# Altium schematic sheet [17] - PLUGS.SchDoc
size A4; DrawnBy: Philip Rowse
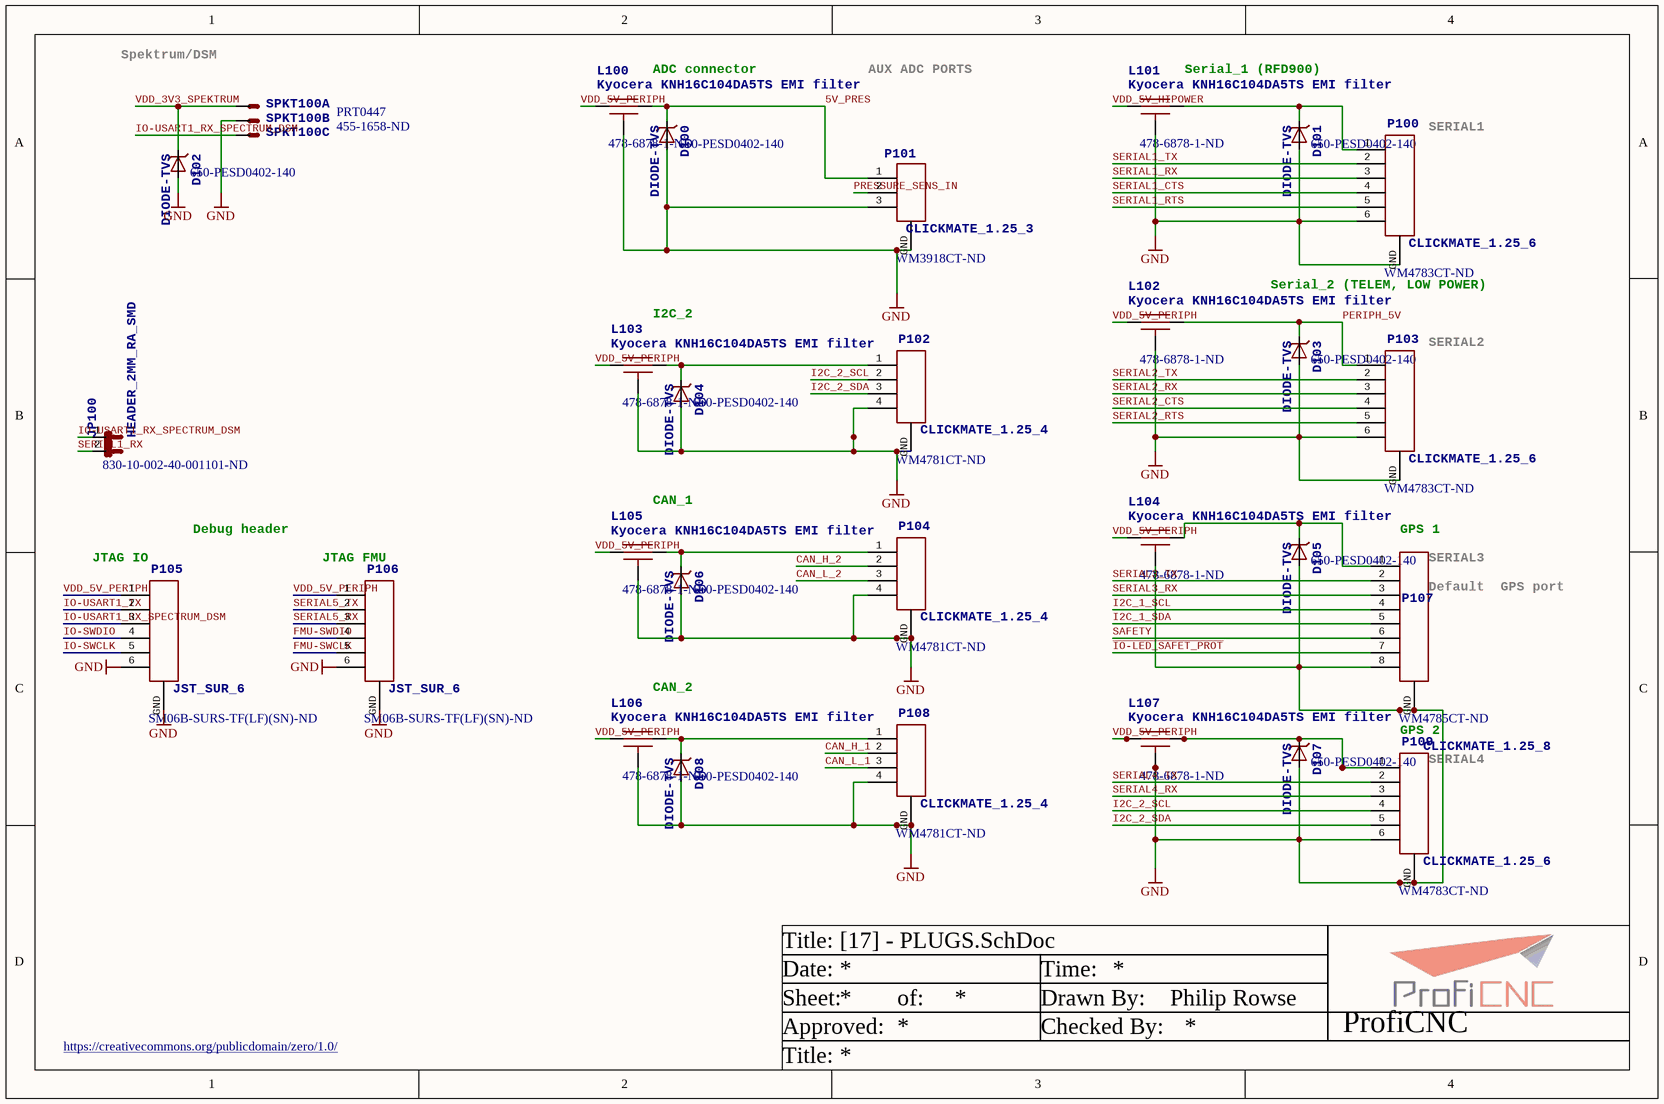
[diagram p0: [17] - PLUGS.SchDoc]

## Parts
D100  DIODE-TVS  Supplier Part Number 1: 650-PESD0402-140  [0402-TVS]
D101  DIODE-TVS  Supplier Part Number 1: 650-PESD0402-140  [0402-TVS]
D102  DIODE-TVS  Supplier Part Number 1: 650-PESD0402-140  [0402-TVS]
D103  DIODE-TVS  Supplier Part Number 1: 650-PESD0402-140  [0402-TVS]
D104  DIODE-TVS  Supplier Part Number 1: 650-PESD0402-140  [0402-TVS]
D105  DIODE-TVS  Supplier Part Number 1: 650-PESD0402-140  [0402-TVS]
D106  DIODE-TVS  Supplier Part Number 1: 650-PESD0402-140  [0402-TVS]
D107  DIODE-TVS  Supplier Part Number 1: 650-PESD0402-140  [0402-TVS]
D108  DIODE-TVS  Supplier Part Number 1: 650-PESD0402-140  [0402-TVS]
JP100  HEADER_2MM_RA_SMD  Supplier Part Number 1: 830-10-002-40-001101-ND  [HEADER_2MM_RA_2]
L100  Kyocera KNH16C104DA5TS EMI filter  Supplier Part Number 1: 478-6878-1-ND  [KYOCERA-KNH16-DA]
L101  Kyocera KNH16C104DA5TS EMI filter  Supplier Part Number 1: 478-6878-1-ND  [KYOCERA-KNH16-DA]
L102  Kyocera KNH16C104DA5TS EMI filter  Supplier Part Number 1: 478-6878-1-ND  [KYOCERA-KNH16-DA]
L103  Kyocera KNH16C104DA5TS EMI filter  Supplier Part Number 1: 478-6878-1-ND  [KYOCERA-KNH16-DA]
L104  Kyocera KNH16C104DA5TS EMI filter  Supplier Part Number 1: 478-6878-1-ND  [KYOCERA-KNH16-DA]
L105  Kyocera KNH16C104DA5TS EMI filter  Supplier Part Number 1: 478-6878-1-ND  [KYOCERA-KNH16-DA]
L106  Kyocera KNH16C104DA5TS EMI filter  Supplier Part Number 1: 478-6878-1-ND  [KYOCERA-KNH16-DA]
L107  Kyocera KNH16C104DA5TS EMI filter  Supplier Part Number 1: 478-6878-1-ND  [KYOCERA-KNH16-DA]
P100  CLICKMATE_1.25_6  Supplier Part Number 1: WM4783CT-ND  [CLICKMATE_V6]
P101  CLICKMATE_1.25_3  Supplier Part Number 1: WM3918CT-ND  [CLICKMATE_V3]
P102  CLICKMATE_1.25_4  Supplier Part Number 1: WM4781CT-ND  [CLICKMATE_V4]
P103  CLICKMATE_1.25_6  Supplier Part Number 1: WM4783CT-ND  [CLICKMATE_V6]
P104  CLICKMATE_1.25_4  Supplier Part Number 1: WM4781CT-ND  [CLICKMATE_V4]
P105  JST_SUR_6  Supplier Part Number 1: SM06B-SURS-TF(LF)(SN)-ND  [JST_SUR_H6]
P106  JST_SUR_6  Supplier Part Number 1: SM06B-SURS-TF(LF)(SN)-ND  [JST_SUR_H6]
P107  CLICKMATE_1.25_8  Supplier Part Number 1: WM4785CT-ND  [CLICKMATE_V8]
P108  CLICKMATE_1.25_4  Supplier Part Number 1: WM4781CT-ND  [CLICKMATE_V4]
P109  CLICKMATE_1.25_6  Supplier Part Number 1: WM4783CT-ND  [CLICKMATE_V6]
SPKT100  CONN_SPEKTRUM_RX-TH  [B3B-ZR]  (value not drawn)  (parts A,B,C of 3)

## Nets
GND: D100.A D101.A D102.A D103.A D104.A D105.A D106.A D107.A D108.A L100.GND L101.GND L102.GND L103.GND L104.GND L105.GND L106.GND L107.GND P100.6 P100.GND P101.3 P101.GND P102.4 P102.GND P103.6 P103.GND P104.4 P104.GND P105.6 P105.GND P106.6 P106.GND P107.8 P107.GND P108.4 P108.GND P109.6 P109.GND SPKT100.2(S)
5V_PRES: D100.C L100.P$2 P101.1
CAN_H_1: P108.2
CAN_H_2: P104.2
CAN_L_1: P108.3
CAN_L_2: P104.3
FMU-SWCLK: P106.5
FMU-SWDIO: P106.4
I2C_1_SCL: P107.4
I2C_1_SDA: P107.5
I2C_2_SCL: P102.2 P109.4
I2C_2_SDA: P102.3 P109.5
~{IO-LED_SAFET_PROT}: P107.7
IO-SWCLK: P105.5
IO-SWDIO: P105.4
IO-USART1_RX_SPECTRUM_DSM: JP100.1 P105.3 SPKT100.1(S)
IO-USART1_TX: P105.2
PERIPH_5V: D103.C L102.P$2 P103.1
PRESSURE_SENS_IN: P101.2
SAFETY: P107.6
SERIAL1_CTS: P100.4
SERIAL1_RTS: P100.5
SERIAL1_RX: JP100.2 P100.3
SERIAL1_TX: P100.2
SERIAL2_CTS: P103.4
SERIAL2_RTS: P103.5
SERIAL2_RX: P103.3
SERIAL2_TX: P103.2
SERIAL3_RX: P107.3
SERIAL3_TX: P107.2
SERIAL4_RX: P109.3
SERIAL4_TX: P109.2
SERIAL5_RX: P106.3
SERIAL5_TX: P106.2
VDD_3V3_SPEKTRUM: D102.C SPKT100.3(S)
VDD_5V_HIPOWER: L101.P$1
VDD_5V_PERIPH: L100.P$1 L102.P$1 L103.P$1 L104.P$1 L105.P$1 L106.P$1 L107.P$1 P105.1 P106.1
NetD101_C: D101.C L101.P$2 P100.1
NetD104_C: D104.C L103.P$2 P102.1
NetD105_C: D105.C L104.P$2 P107.1
NetD106_C: D106.C L105.P$2 P104.1
NetD107_C: D107.C L107.P$2 P109.1
NetD108_C: D108.C L106.P$2 P108.1

## Notes on the sheet
- Spektrum/DSM
- (near L100) ADC connector
- AUX ADC PORTS
- (near L101) Serial_1 (RFD900)
- (near P100) SERIAL1
- (near L103) I2C_2
- Serial_2 (TELEM, LOW POWER)
- (near P103) SERIAL2
- Debug header
- (near L105) CAN_1
- (near P107) GPS 1
- (near P105) JTAG IO
- (near P106) JTAG FMU
- (near P107) SERIAL3
- (near P107) Default
  GPS port
- (near L106) CAN_2
- GPS 2
- (near P109) SERIAL4
- Title:
- Date:
- Time:
- https://creativecommons.org/publicdomain/zero/1.0/
- Sheet:
- Approved:
- of:
- Drawn By:
- Checked By:
- ProfiCNC

## Library data of the parts
D100-D108 = DIODE-TVS: Diode, TVS, 14VWM, 40VC, 0402, SMD; 3DR_PARTNO: ECM0837; Supplier 1: Mouser
JP100 = HEADER_2MM_RA_SMD: Connector, PCB, 2MM, 2Pos, R/A, SMD, Au; PARTNO: 830-10-002-40-001101; 3DR_PARTNO: PRT0437; Supplier 1: Digi-Key
L100-L107 = KNH16C104DA5TS: Capacitor, Filter, 0.1uF, 25V, 2A, 0603, SMD; 3DR_PARTNO: ECM0719; Supplier 1: Digi-Key
P100 P103 P109 = CLICKMATE_1.25_6: Connector, Rcpt, 6Pos, 1.25MM, W/B, VERT, SMD, Tin; 3DR_PARTNO: PRT0439; Supplier 1: Digi-Key
P101 = CLICKMATE_1.25_3: Connector, Rcpt,1.25MM,W/B,SGL,S/T,3CKT,SMD,Tin; 3DR_PARTNO: PRT0440; Supplier 1: Digi-Key
P102 P104 P108 = CLICKMATE_1.25_4: Connector, Rcpt, 4Pos, 1.25MM, W/B, VERT, SMD, Tin; 3DR_PARTNO: PRT0441; Supplier 1: Digi-Key
P105 P106 = JST_SUR_6: Connector, Header, 6Pos, .8mm IDC, R/A, SMD, Tin; 3DR_PARTNO: PRT0442; Supplier 1: Digi-Key
P107 = CLICKMATE_1.25_8: Connector, Rcpt, 8Pos, 1.25MM, W/B, VERT, SMD, Tin; 3DR_PARTNO: PRT0443; Supplier 1: Digi-Key
SPKT100 = CONN_SPEKTRUM_RX-TH: Spektrum RX connector; JST ZH series S3B-ZR-SM4A-TF; PARTNO: B3B-ZR(LF)(SN); 3DR_PARTNO: PRT0447